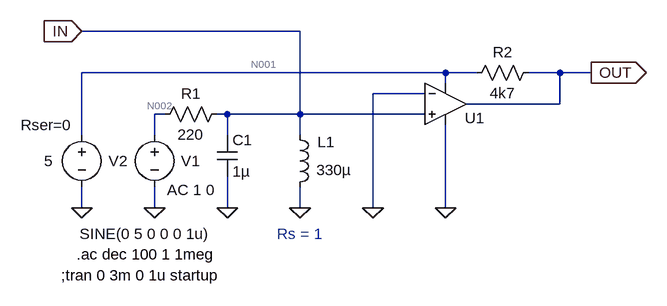
[diagram p0: schematic Inductometer.asc]
Inductometer.asc, the LTspice schematic file:
Version 4
SHEET 1 880 680
WIRE 272 -32 -64 -32
WIRE 496 32 -64 32
WIRE 544 32 496 32
WIRE 672 32 624 32
WIRE 720 32 672 32
WIRE 496 48 496 32
WIRE 464 64 384 64
WIRE 672 80 672 32
WIRE 672 80 528 80
WIRE 64 96 48 96
WIRE 160 96 144 96
WIRE 272 96 272 -32
WIRE 272 96 160 96
WIRE 464 96 272 96
WIRE -64 128 -64 32
WIRE 48 128 48 96
WIRE 160 128 160 96
WIRE 272 128 272 96
WIRE -64 240 -64 208
WIRE 48 240 48 208
WIRE 160 240 160 192
WIRE 272 240 272 208
WIRE 384 240 384 64
WIRE 496 240 496 112
FLAG 160 240 0
FLAG 272 240 0
FLAG 384 240 0
FLAG 48 240 0
FLAG 496 240 0
FLAG -64 240 0
FLAG 720 32 OUT
IOPIN 720 32 Out
FLAG -64 -32 IN
IOPIN -64 -32 In
SYMBOL ind 256 112 R0
WINDOW 0 43 27 Left 2
WINDOW 3 41 70 Left 2
SYMATTR InstName L1
SYMATTR Value 330µ
SYMATTR SpiceLine Rser=1
SYMBOL cap 144 128 R0
SYMATTR InstName C1
SYMATTR Value 1µ
SYMBOL res 160 80 R90
WINDOW 0 0 56 VBottom 2
WINDOW 3 32 56 VTop 2
SYMATTR InstName R1
SYMATTR Value 220
SYMBOL voltage 48 112 R0
WINDOW 0 41 56 Left 2
WINDOW 3 -115 168 Left 2
WINDOW 123 19 101 Left 2
WINDOW 39 0 0 Left 0
SYMATTR InstName V1
SYMATTR Value SINE(0 5 0 0 0 1u)
SYMATTR Value2 AC 1 0
SYMBOL voltage -64 112 R0
WINDOW 0 41 56 Left 2
WINDOW 3 -58 56 Left 2
WINDOW 123 0 0 Left 0
WINDOW 39 -94 1 Left 2
SYMATTR InstName V2
SYMATTR Value 5
SYMATTR SpiceLine Rser=0
SYMBOL res 640 16 R90
WINDOW 0 0 56 VBottom 2
WINDOW 3 32 56 VTop 2
SYMATTR InstName R2
SYMATTR Value 4k7
SYMBOL OpAmps\\UniversalOpAmp2 496 80 R0
WINDOW 0 30 22 Left 2
SYMATTR InstName U1
TEXT -96 344 Left 2 !;tran 0 3m 0 1u startup
TEXT -72 312 Left 2 !.ac dec 100 1 1meg
TEXT 272 280 Center 2 ;Rs = 1

The netlist it stands for:
* Inductometer.asc
L1 IN 0 330µ Rser=1
C1 IN 0 1µ
R1 IN N002 220
V1 N002 0 SINE(0 5 0 0 0 1u) AC 1 0
V2 N001 0 5 Rser=0
R2 OUT N001 4k7
XU1 IN 0 N001 0 OUT level2 Avol=1Meg GBW=10Meg Slew=10Meg Ilimit=25m Rail=0 Vos=0 En=0 Enk=0 In=0 Ink=0 Rin=500Meg  ; pins In+ In- V+ V- OUT
;tran 0 3m 0 1u startup
.ac dec 100 1 1meg
* Rs = 1
.lib UniversalOpAmp2.lib
.backanno
.end

* Results of the author's LTspice run, read from the files saved beside the schematic
* Operating Point, zero values left out:
*   V(in) = 5.372 nV
*   V(n002) = 87.27 nV
*   V(n001) = 5 V
*   V(out) = 2.526 V
*   I(L1) = 5.372 nA
*   I(R1) = -372.2 pA
*   I(R2) = -526.4 µA
*   I(V1) = -372.2 pA
*   I(V2) = -626.2 µA
*   Ix(u1:1) = -5 nA
*   Ix(u1:2) = -5 nA
*   Ix(u1:3) = 99.81 µA
*   Ix(u1:4) = -626.2 µA
*   Ix(u1:5) = 526.4 µA
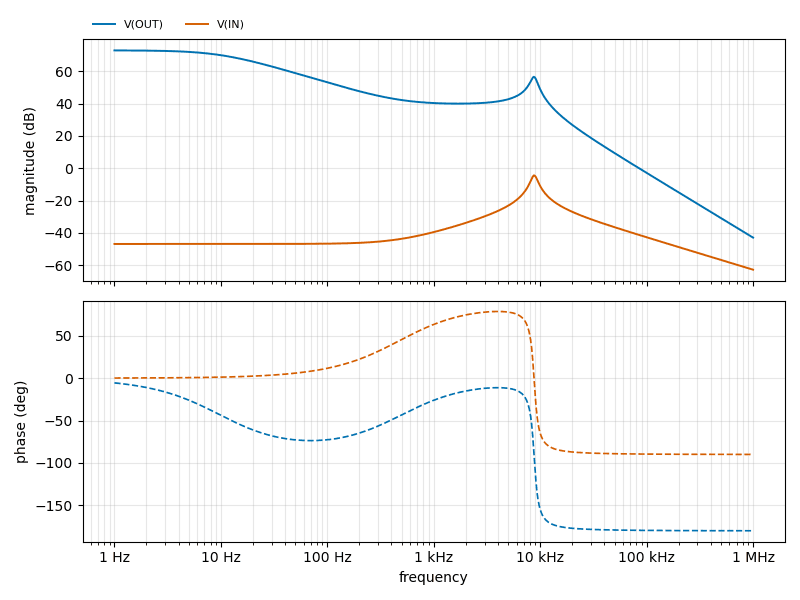
[diagram p1: AC Analysis of Inductometer.asc, plotted from the saved traces]
* AC Analysis, 1 run:
*   V(OUT): 72.93 dB at 1 Hz, -42.95 dB at 1 MHz, peak 72.93 dB at 1 Hz, 3 dB below the peak at 10.1 Hz
*   V(IN): -46.89 dB at 1 Hz, -62.81 dB at 1 MHz, peak -4.48 dB at 8.71 kHz, 3 dB below the peak at 8.191 kHz and 9.414 kHz